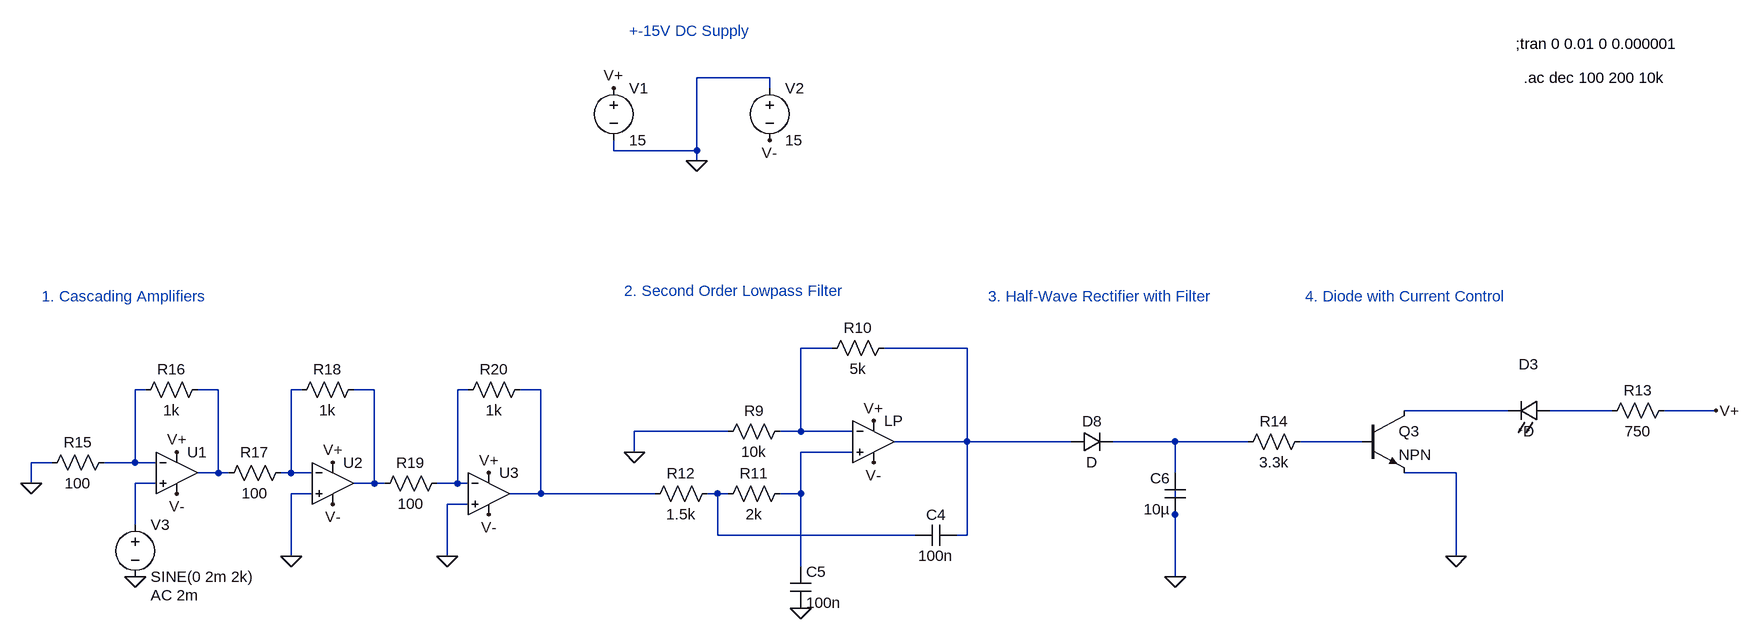
[diagram p0: schematic LP_TEST.asc]
LP_TEST.asc, the LTspice schematic file:
Version 4
SHEET 1 3332 1340
WIRE -480 -368 -592 -368
WIRE -480 -352 -480 -368
WIRE -720 -256 -720 -272
WIRE -592 -256 -592 -368
WIRE -592 -256 -720 -256
WIRE -592 -240 -592 -256
WIRE -384 48 -432 48
WIRE -176 48 -304 48
WIRE -1440 112 -1456 112
WIRE -1328 112 -1360 112
WIRE -1200 112 -1216 112
WIRE -1088 112 -1120 112
WIRE -944 112 -960 112
WIRE -832 112 -864 112
WIRE 656 144 496 144
WIRE 816 144 720 144
WIRE 976 144 896 144
WIRE -544 176 -688 176
WIRE -432 176 -432 48
WIRE -432 176 -464 176
WIRE -352 176 -432 176
WIRE -176 192 -176 48
WIRE -176 192 -288 192
WIRE -16 192 -176 192
WIRE 144 192 48 192
WIRE 256 192 144 192
WIRE 432 192 336 192
WIRE -688 208 -688 176
WIRE -352 208 -432 208
WIRE -1584 224 -1616 224
WIRE -1456 224 -1456 112
WIRE -1456 224 -1504 224
WIRE -1424 224 -1456 224
WIRE -1328 240 -1328 112
WIRE -1328 240 -1360 240
WIRE -1312 240 -1328 240
WIRE -1216 240 -1216 112
WIRE -1216 240 -1232 240
WIRE -1184 240 -1216 240
WIRE 144 240 144 192
WIRE 576 240 496 240
WIRE -1616 256 -1616 224
WIRE -1424 256 -1456 256
WIRE -1088 256 -1088 112
WIRE -1088 256 -1120 256
WIRE -1072 256 -1088 256
WIRE -960 256 -960 112
WIRE -960 256 -992 256
WIRE -944 256 -960 256
WIRE -1184 272 -1216 272
WIRE -832 272 -832 112
WIRE -832 272 -880 272
WIRE -656 272 -832 272
WIRE -560 272 -576 272
WIRE -544 272 -560 272
WIRE -432 272 -432 208
WIRE -432 272 -464 272
WIRE -944 288 -976 288
WIRE 144 304 144 256
WIRE -1456 320 -1456 256
WIRE -560 336 -560 272
WIRE -256 336 -560 336
WIRE -176 336 -176 192
WIRE -176 336 -192 336
WIRE -1216 368 -1216 272
WIRE -976 368 -976 288
WIRE 576 368 576 240
WIRE -432 384 -432 272
WIRE 144 400 144 304
FLAG -592 -240 0
FLAG -720 -352 V+
FLAG -480 -272 V-
FLAG -320 160 V+
FLAG -688 208 0
FLAG -432 448 0
FLAG -320 224 V-
FLAG 576 368 0
FLAG 144 400 0
FLAG -912 240 V+
FLAG -1152 224 V+
FLAG -1392 208 V+
FLAG -912 304 V-
FLAG -1152 288 V-
FLAG -1392 272 V-
FLAG -1616 256 0
FLAG -1216 368 0
FLAG -976 368 0
FLAG -1456 400 0
FLAG 976 144 V+
SYMBOL voltage -720 -368 R0
SYMATTR InstName V1
SYMATTR Value 15
SYMBOL voltage -480 -368 R0
SYMATTR InstName V2
SYMATTR Value 15
SYMBOL OpAmps/UniversalOpAmp -320 192 R0
SYMATTR InstName LP
SYMBOL res -448 160 R90
WINDOW 0 0 56 VBottom 2
WINDOW 3 32 56 VTop 2
SYMATTR InstName R9
SYMATTR Value 10k
SYMBOL res -288 32 R90
WINDOW 0 0 56 VBottom 2
WINDOW 3 32 56 VTop 2
SYMATTR InstName R10
SYMATTR Value 5k
SYMBOL res -448 256 R90
WINDOW 0 0 56 VBottom 2
WINDOW 3 32 56 VTop 2
SYMATTR InstName R11
SYMATTR Value 2k
SYMBOL res -560 256 R90
WINDOW 0 0 56 VBottom 2
WINDOW 3 32 56 VTop 2
SYMATTR InstName R12
SYMATTR Value 1.5k
SYMBOL cap -192 320 R90
WINDOW 0 0 32 VBottom 2
WINDOW 3 32 32 VTop 2
SYMATTR InstName C4
SYMATTR Value 100n
SYMBOL cap -448 384 R0
SYMATTR InstName C5
SYMATTR Value 100n
SYMBOL npn 432 144 R0
SYMATTR InstName Q3
SYMBOL LED 720 160 M270
WINDOW 0 72 32 VTop 2
WINDOW 3 0 32 VBottom 2
SYMATTR InstName D3
SYMBOL res 912 128 R90
WINDOW 0 0 56 VBottom 2
WINDOW 3 32 56 VTop 2
SYMATTR InstName R13
SYMATTR Value 750
SYMBOL diode -16 208 R270
WINDOW 0 32 32 VTop 2
WINDOW 3 0 32 VBottom 2
SYMATTR InstName D8
SYMBOL cap 160 304 R180
WINDOW 0 24 56 Left 2
WINDOW 3 24 8 Left 2
SYMATTR InstName C6
SYMATTR Value 10µ
SYMBOL res 352 176 R90
WINDOW 0 0 56 VBottom 2
WINDOW 3 32 56 VTop 2
SYMATTR InstName R14
SYMATTR Value 3.3k
SYMBOL OpAmps\\UniversalOpAmp -1392 240 R0
SYMATTR InstName U1
SYMBOL OpAmps\\UniversalOpAmp -1152 256 R0
SYMATTR InstName U2
SYMBOL OpAmps\\UniversalOpAmp -912 272 R0
SYMATTR InstName U3
SYMBOL res -1488 208 R90
WINDOW 0 0 56 VBottom 2
WINDOW 3 32 56 VTop 2
SYMATTR InstName R15
SYMATTR Value 100
SYMBOL res -1344 96 R90
WINDOW 0 0 56 VBottom 2
WINDOW 3 32 56 VTop 2
SYMATTR InstName R16
SYMATTR Value 1k
SYMBOL res -1216 224 R90
WINDOW 0 0 56 VBottom 2
WINDOW 3 32 56 VTop 2
SYMATTR InstName R17
SYMATTR Value 100
SYMBOL res -1104 96 R90
WINDOW 0 0 56 VBottom 2
WINDOW 3 32 56 VTop 2
SYMATTR InstName R18
SYMATTR Value 1k
SYMBOL res -976 240 R90
WINDOW 0 0 56 VBottom 2
WINDOW 3 32 56 VTop 2
SYMATTR InstName R19
SYMATTR Value 100
SYMBOL res -848 96 R90
WINDOW 0 0 56 VBottom 2
WINDOW 3 32 56 VTop 2
SYMATTR InstName R20
SYMATTR Value 1k
SYMBOL voltage -1456 304 R0
WINDOW 123 24 124 Left 2
WINDOW 39 0 0 Left 0
SYMATTR InstName V3
SYMATTR Value SINE(0 2m 2k)
SYMATTR Value2 AC 2m
TEXT -704 -40 Left 2 ;2. Second Order Lowpass Filter
TEXT -1600 -32 Left 2 ;1. Cascading Amplifiers
TEXT 668 -420 Left 2 !;tran 0 0.01 0 0.000001
TEXT -144 -32 Left 2 ;3. Half-Wave Rectifier with Filter
TEXT 344 -32 Left 2 ;4. Diode with Current Control
TEXT -696 -440 Left 2 ;+-15V DC Supply
TEXT 680 -368 Left 2 !.ac dec 100 200 10k

The netlist it stands for:
* LP_TEST.asc
V1 V+ 0 15
V2 0 V- 15
XLP N013 N001 V+ V- N002 level1 Avol=1Meg GBW=10Meg Vos=0 En=0 Enk=0 In=0 Ink=0 Rin=500Meg  ; pins In+ In- V+ V- OUT
R9 N001 0 10k
R10 N002 N001 5k
R11 N013 N015 2k
R12 N015 N008 1.5k
C4 N002 N015 100n
C5 N013 0 100n
Q3 N009 N012 0 0 NPN
D3 N010 N009 D
R13 V+ N010 750
D8 N002 N011 D
C6 0 N011 10µ
R14 N012 N011 3.3k
XU1 N014 N003 V+ V- N004 level1 Avol=1Meg GBW=10Meg Vos=0 En=0 Enk=0 In=0 Ink=0 Rin=500Meg  ; pins In+ In- V+ V- OUT
XU2 0 N005 V+ V- N006 level1 Avol=1Meg GBW=10Meg Vos=0 En=0 Enk=0 In=0 Ink=0 Rin=500Meg  ; pins In+ In- V+ V- OUT
XU3 0 N007 V+ V- N008 level1 Avol=1Meg GBW=10Meg Vos=0 En=0 Enk=0 In=0 Ink=0 Rin=500Meg  ; pins In+ In- V+ V- OUT
R15 N003 0 100
R16 N004 N003 1k
R17 N005 N004 100
R18 N006 N005 1k
R19 N007 N006 100
R20 N008 N007 1k
V3 N014 0 SINE(0 2m 2k) AC 2m
.model D D
.lib standard.dio
.model NPN NPN
.model PNP PNP
.lib standard.bjt
* 2. Second Order Lowpass Filter
* 1. Cascading Amplifiers
;tran 0 0.01 0 0.000001
* 3. Half-Wave Rectifier with Filter
* 4. Diode with Current Control
* +-15V DC Supply
.ac dec 100 200 10k
.lib UniversalOpAmp1.lib
.backanno
.end